# EAGLE board swift-nav (EAGLE 6.2), part 1 of 2
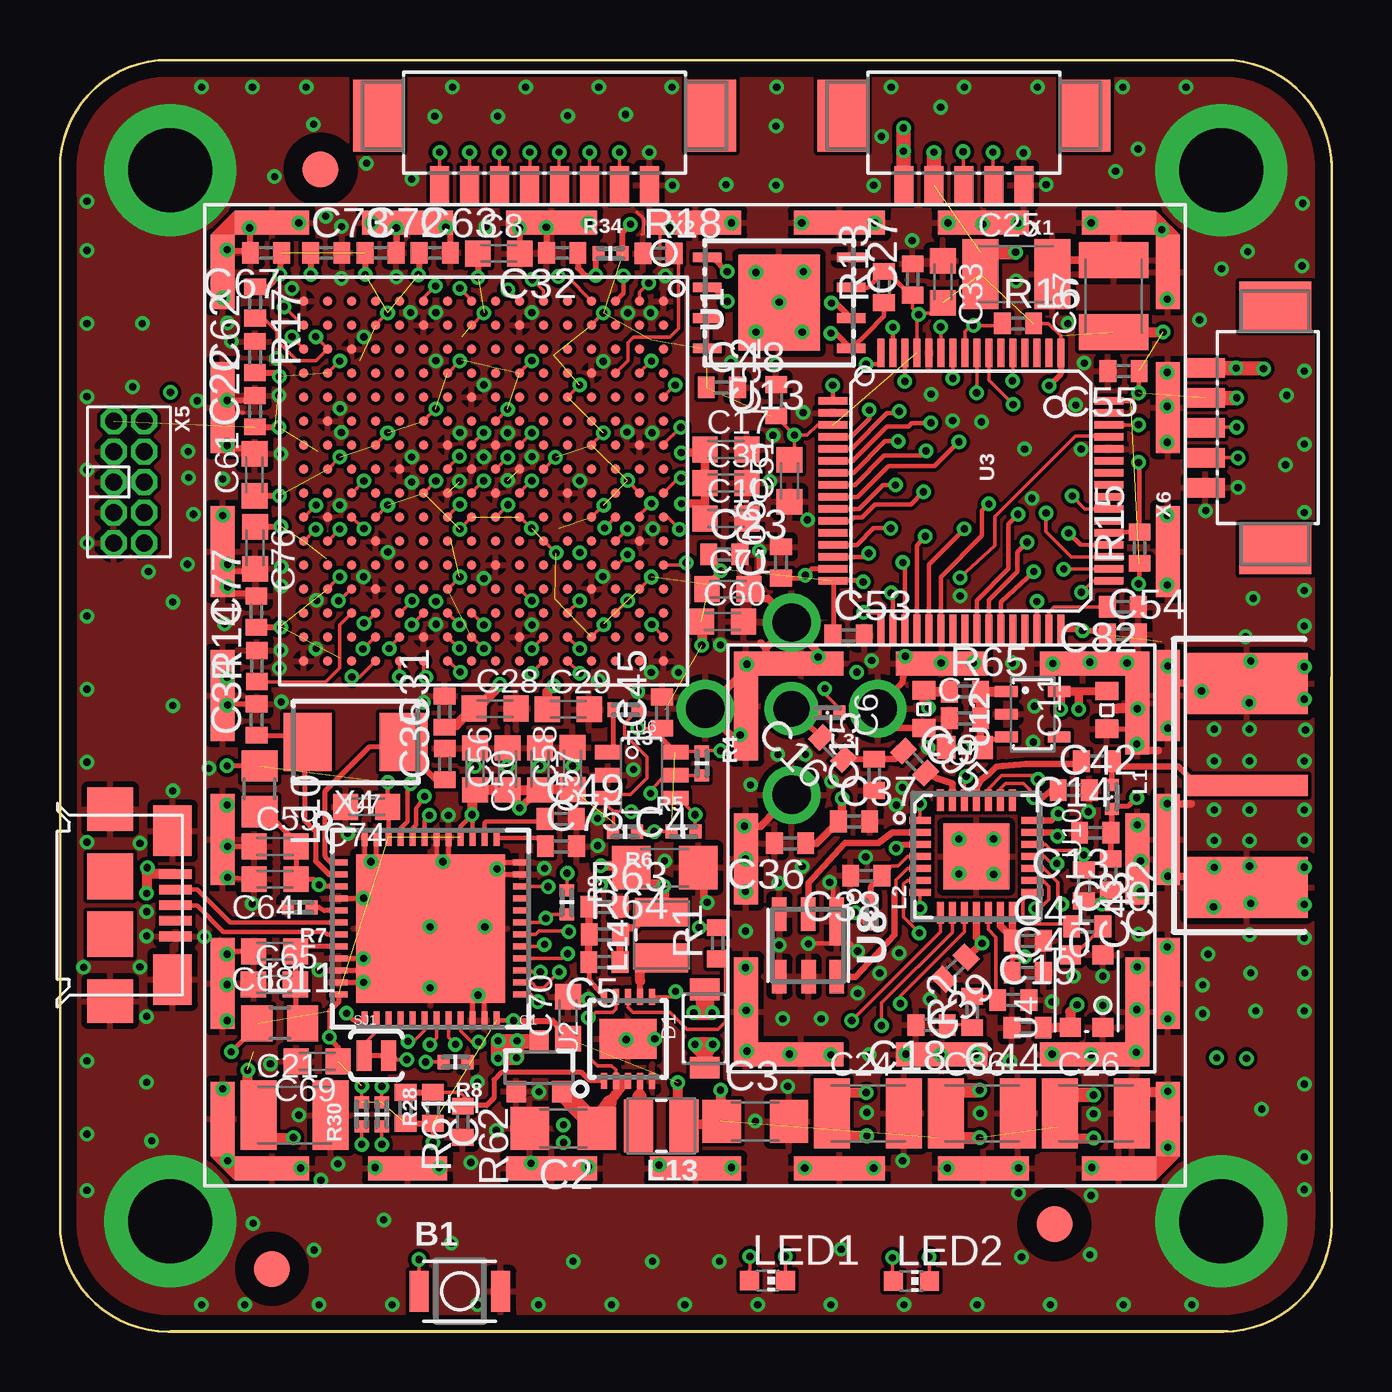
[diagram p4: board, top side]
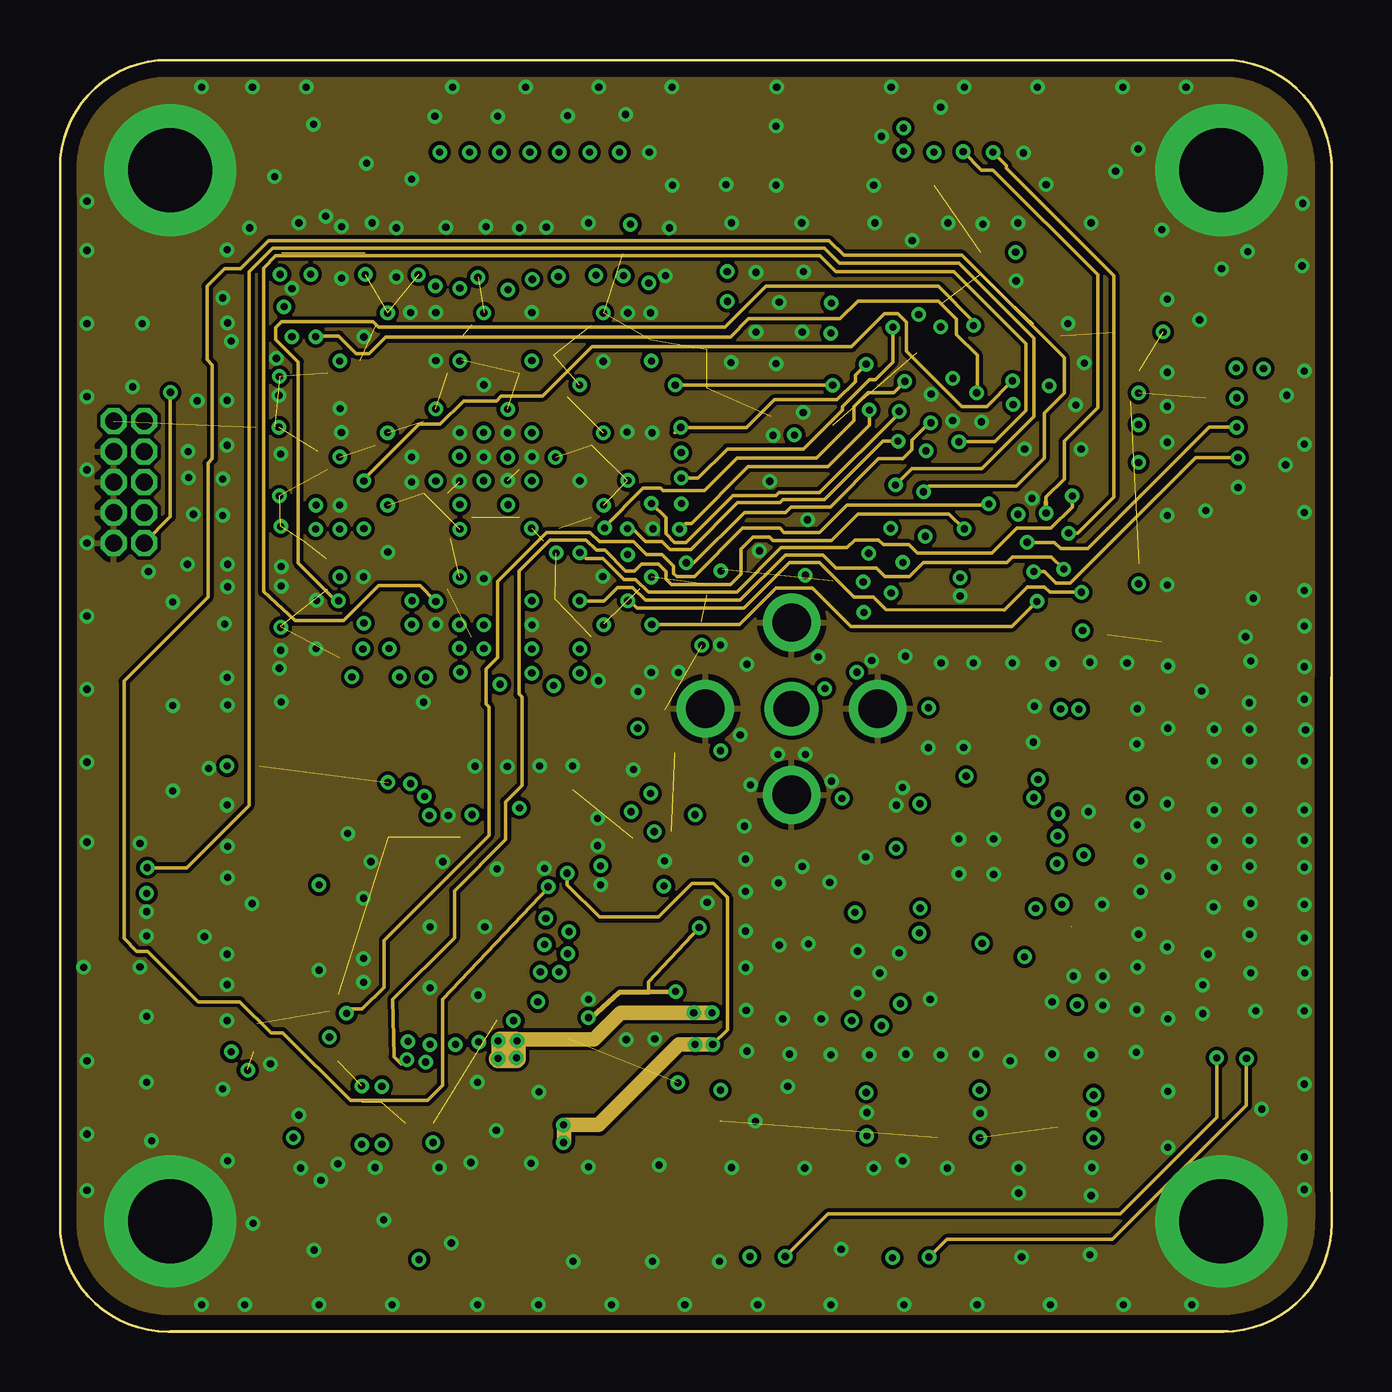
[diagram p5: board, inner layer Route2]
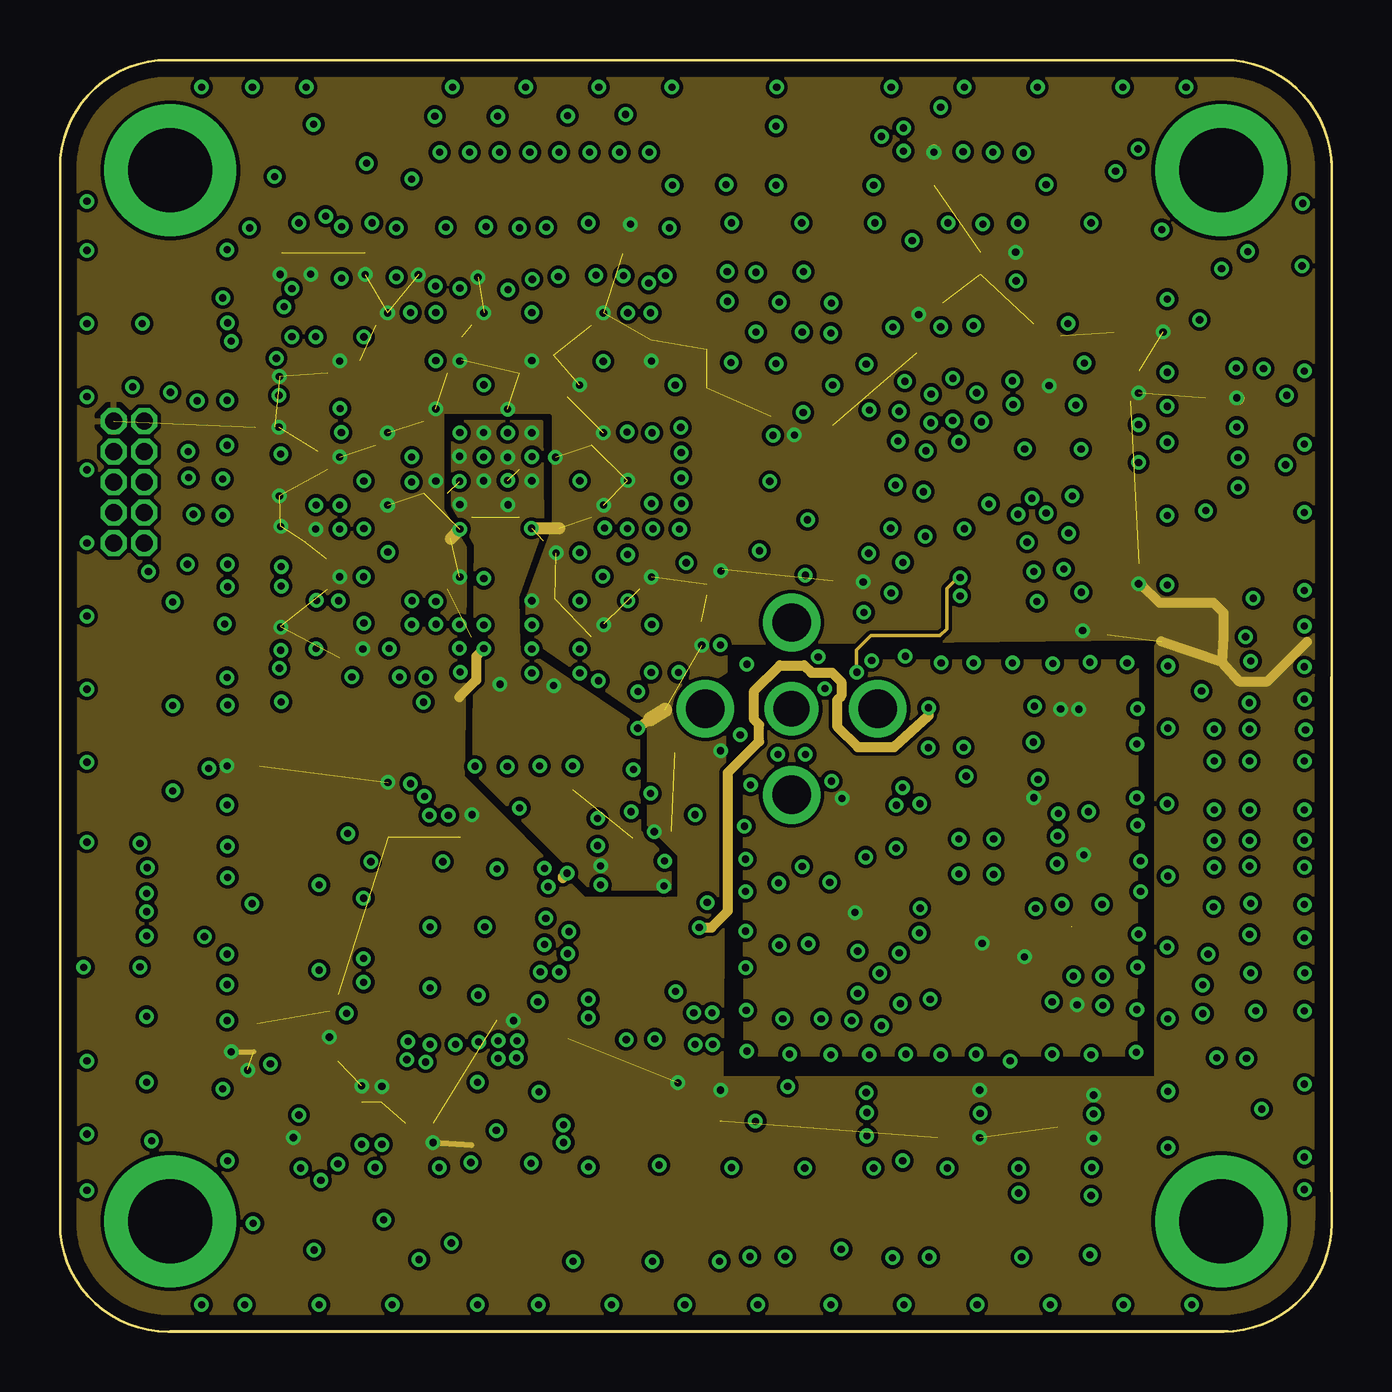
[diagram p6: board, inner layer Route3]
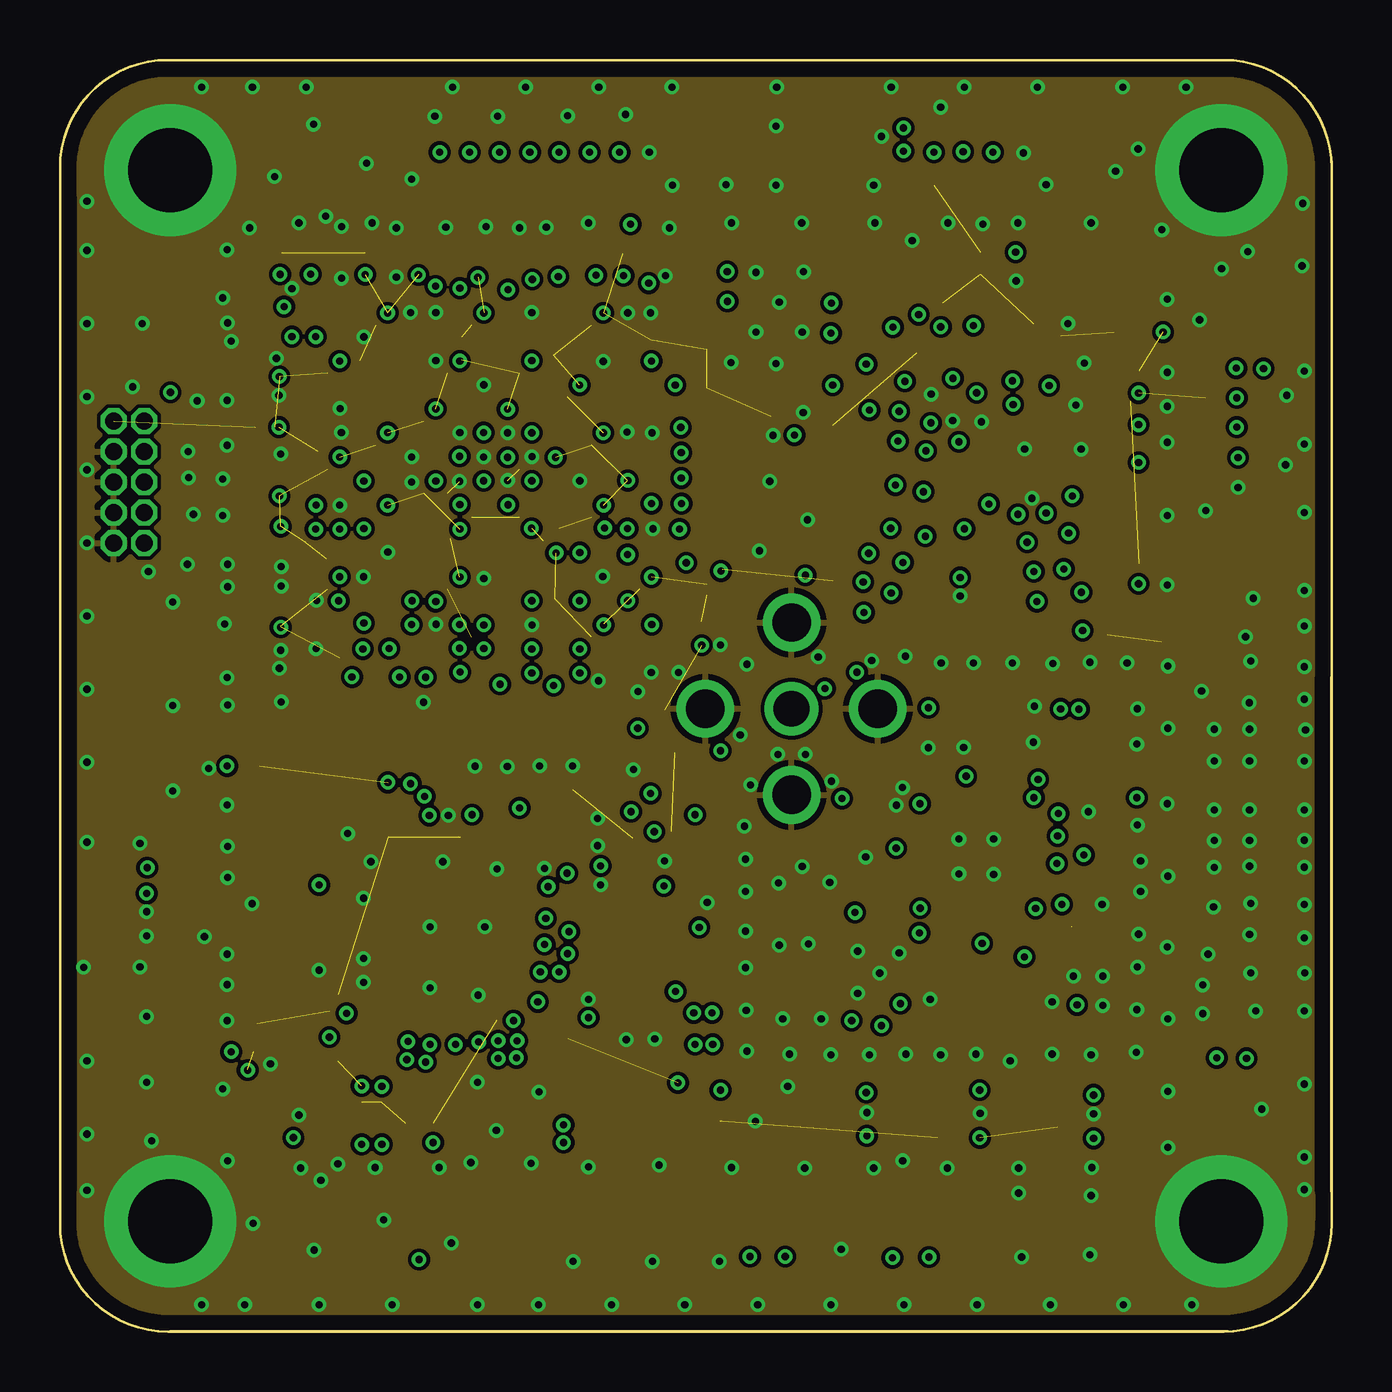
[diagram p7: board, inner layer Route14]
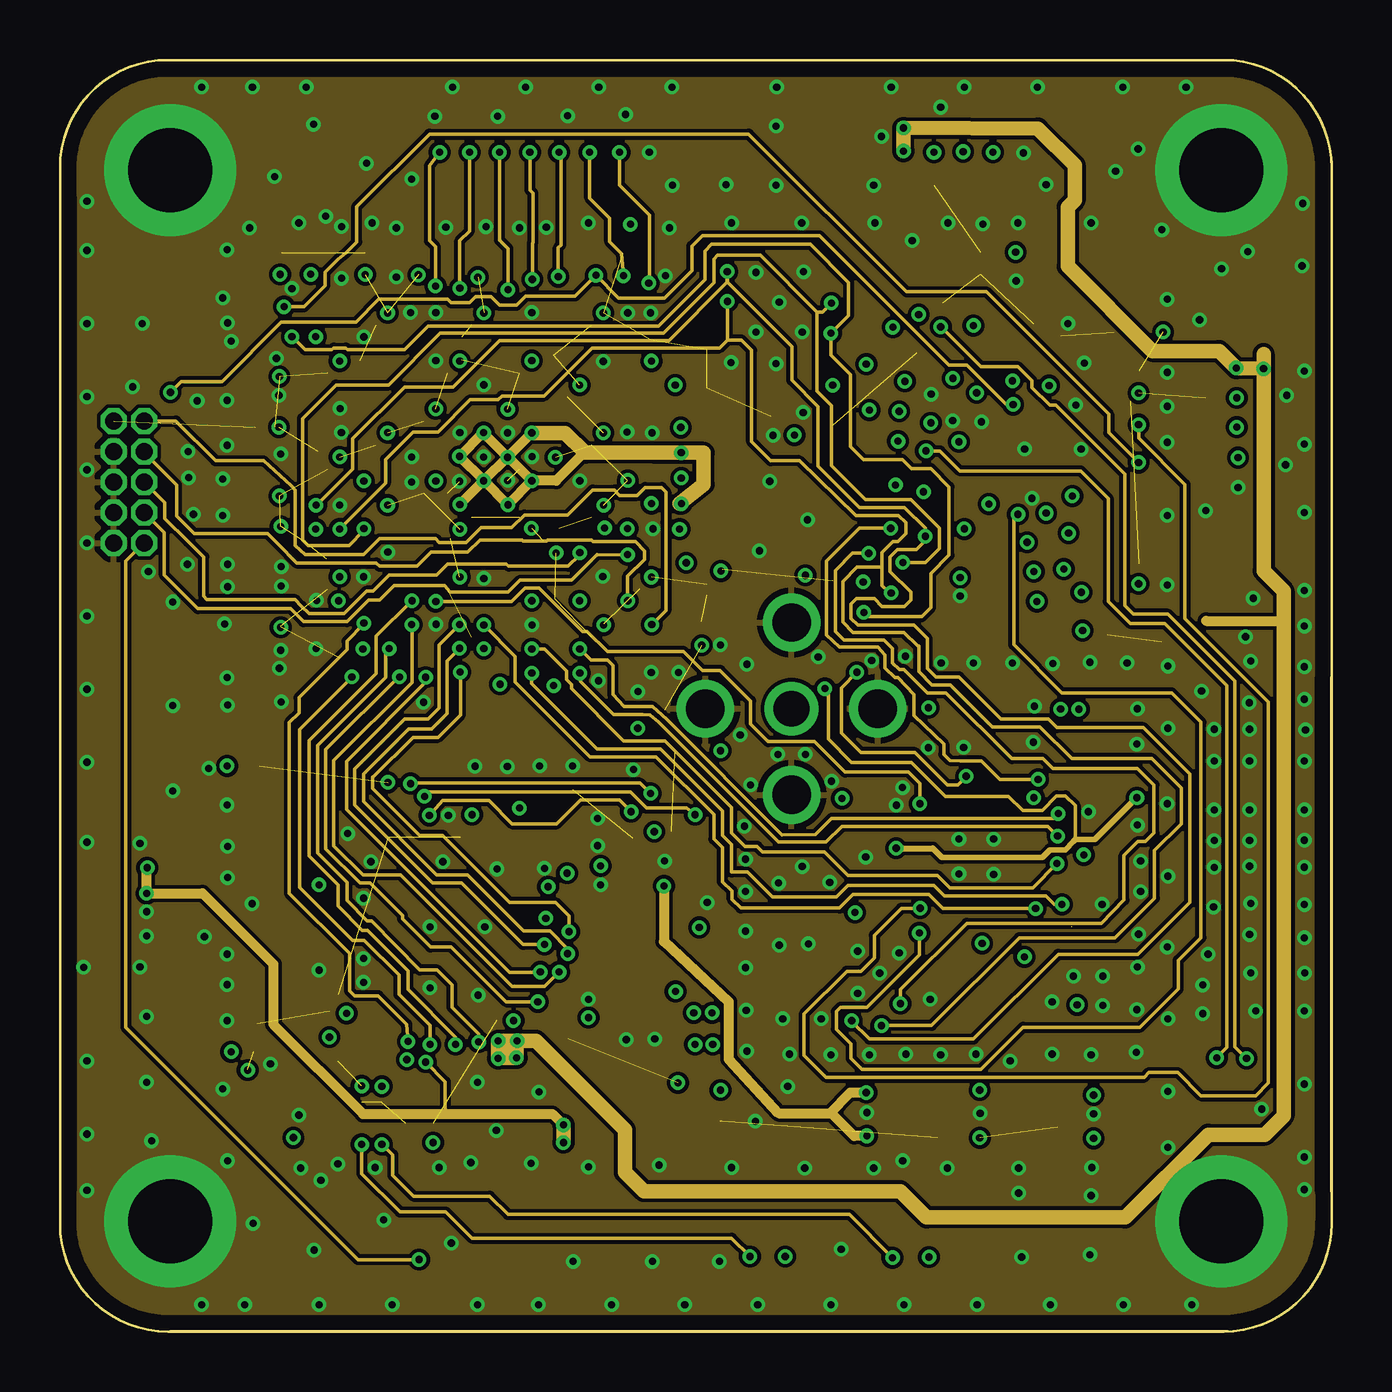
[diagram p8: board, inner layer Route15]
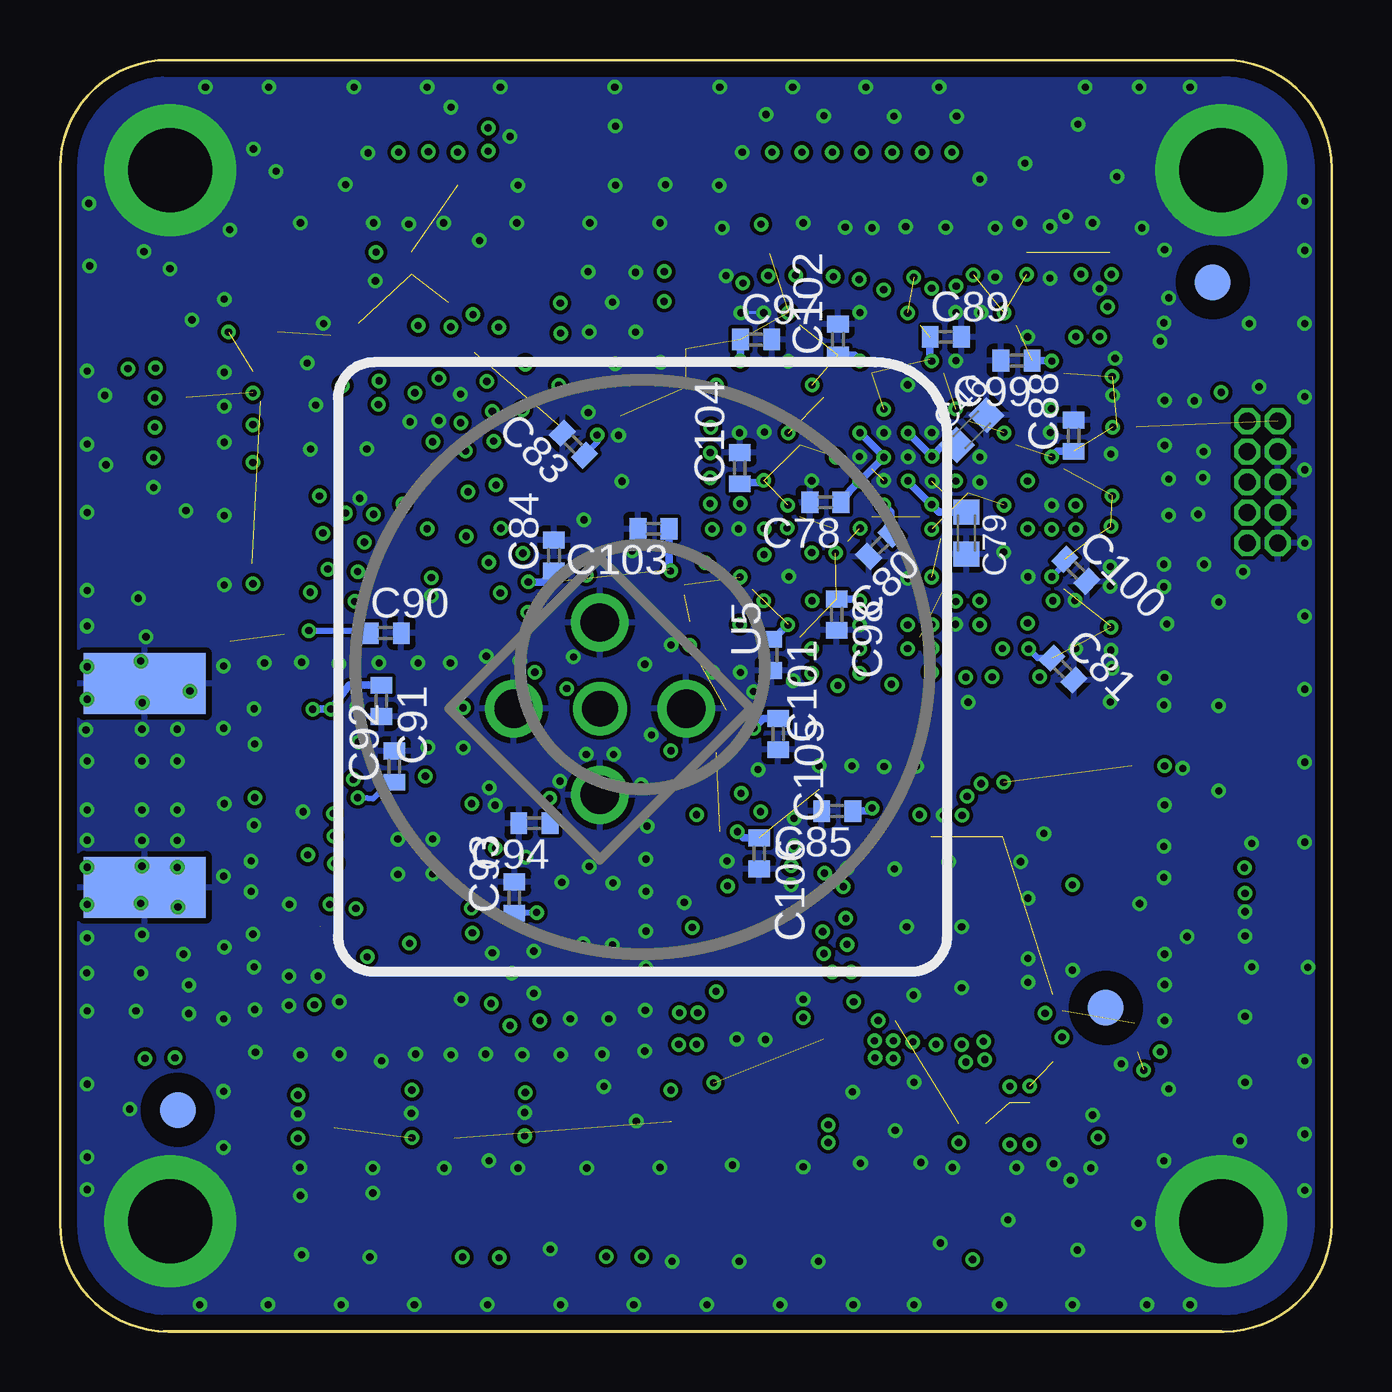
[diagram p9: board, bottom side, seen from below]

Size 53 x 53 mm. Coordinates in mm from the lower left corner, seen from the top.
Outline: 48.67,53 4.6,53
Outline: 0,47.3 0,5.86
Outline: 4.6,0 48.68,0
Outline: 53,5.85 53,48.76
Outline: 4.5,53 48.5,53 arc-90 53,48.5 53,4.5 arc-90 48.5,0 4.5,0 arc-90 0,4.5 0,48.5 arc-90 4.5,53
Copper layers (1+2*3+14*15+16): Top 0.0175mm / dielectric 0.15mm / Route2 0.0175mm / dielectric 0.5mm / Route3 0.0175mm / dielectric 0.15mm / Route14 0.0175mm / dielectric 0.5mm / Route15 0.0175mm / dielectric 0.15mm / Bottom 0.0175mm
Design rules: minimum track width 6mil, minimum drill 0.3mm, track to track 6mil, track to pad 6mil, pad to pad 6mil, via to via 6mil, smd to smd 6mil, copper to edge 25mil, drill to drill 8mil, minimum pad ring 7.5mil, minimum via ring 6mil, stop-mask expansion 3mil, vias tented up to drill 0.4mm, thermal gap 10mil

## Footprints (pad centres in the part's own frame; a part is rotated, then mirrored left to right if it is on the bottom)
B3U-1000P = smd 0.8 x 1.7: P$1 -1.7,0; P$2 1.7,0
C0402 = smd 0.7 x 0.9: 1 -0.65,0; 2 0.65,0
C1206 = smd 1.6 x 1.8: 1 -1.4,0; 2 1.4,0
0603 = smd 0.762 x 0.965: 1 -0.787,0; 2 0.787,0
C0603K = smd 1.05 x 1.08: 1 -0.875,0; 2 0.875,0
C1210K = smd 1.5 x 2.9: 1 -1.5,0; 2 1.5,0
SOD-123 = smd 0.914 x 1.219: 1 -1.626,0; 2 1.626,0
M3-PAD = drill 3.5 pad 5.5: B3,0 0,0
SMA_EDGE = smd 0.889 x 5.08: P1 0,-2.54 | smd 2.54 x 5.08: P2 -4.242,-2.54; P3 4.242,-2.54 | smd 2.54 x 5.08 bottom: P4 -4.242,-2.54; P5 4.242,-2.54
ZX62-B-5PA = smd 1.8 x 1.9: GND_LEFT -4,0; GND_RIGHT 4,0 | smd 1.9 x 1.9: GND_MID_LEFT -1.2,0; GND_MID_RIGHT 1.2,0 | smd 2.1 x 1.6: GND_UP_LEFT -3.1,2.6; GND_UP_RIGHT 3.1,2.6 | smd 0.4 x 1.35: PIN_1 -1.3,2.725; PIN_2 -0.65,2.725; PIN_3 0,2.725; PIN_4 0.65,2.725; PIN_5 1.3,2.725
FIDUCIAL-1.5X3 = smd 1.5 x 1.5: 1 0,0
0402-IND = smd 0.5 x 0.6: P$1 -0.5,0; P$2 0.5,0
R0805 = smd 1.3 x 1.5: 1 -0.95,0; 2 0.95,0
LQM2HPN4R7MG0L = smd 1.2 x 2.2: 1 -0.95,0; 2 0.95,0
CHIP-LED0603 = smd 0.8 x 0.8: A 0,-0.75; C 0,0.75
SOT23-3 = smd 0.8 x 0.9: 1 -0.95,-1; 2 0.95,-1; 3 0,1.1
R0402 = smd 0.7 x 0.9: 1 -0.65,0; 2 0.65,0
0402-RES = smd 0.5 x 0.6: P$1 -0.5,0; P$2 0.5,0
BMI-S-202 = smd 4.55 x 1: 1 2.275,0.5; 3 15.025,0.5; 7 15.025,16.8 | smd 3.8 x 1: 2 8.65,0.5; 8 8.65,16.8 | smd 1 x 3.55: 4 16.8,2.775; 6 16.8,14.525; 10 0.5,14.525; 12 0.5,2.775 | smd 1 x 3.8: 5 16.8,8.65; 11 0.5,8.65 | smd 4.296 x 1: 9 2.148,16.8
BMI-S-208 = smd 3.1 x 1: 1 2.55,0.5; 3 37.85,0.5; 7 37.85,39.9; 9 2.55,39.9 | smd 3.8 x 1: 2 8.2,0.5; 8 8.2,39.9; 13 14.2,0.5; 14 20.2,0.5; 15 26.2,0.5; 16 32.2,0.5; 25 14.2,39.9; 26 20.2,39.9; 27 26.2,39.9; 28 32.2,39.9 | smd 1 x 3.1: 4 39.9,2.55; 6 39.9,37.85; 10 0.5,37.85; 12 0.5,2.55 | smd 1 x 3.3: 5 39.9,8.2 | smd 1 x 3.8: 11 0.5,8.2; 17 39.9,14.2; 18 39.9,20.2; 19 39.9,32.2; 20 0.5,14.2; 21 39.9,26.2; 22 0.5,20.2; 23 0.5,26.2; 24 0.5,32.2
SJ_2S-TRACE = smd 0.635 x 1.27: 1 -0.508,0; 2 0.508,0
FT256 = smd 0.4 x 0.4: A1 -7.5,7.5; A2 -6.5,7.5; A3 -5.5,7.5; A4 -4.5,7.5; A5 -3.5,7.5; A6 -2.5,7.5; A7 -1.5,7.5; A8 -0.5,7.5; A9 0.5,7.5; A10 1.5,7.5; A11 2.5,7.5; A12 3.5,7.5; A13 4.5,7.5; A14 5.5,7.5; A15 6.5,7.5; A16 7.5,7.5; B1 -7.5,6.5; B2 -6.5,6.5; B3 -5.5,6.5; B4 -4.5,6.5; B5 -3.5,6.5; B6 -2.5,6.5; B7 -1.5,6.5; B8 -0.5,6.5; B9 0.5,6.5; B10 1.5,6.5; B11 2.5,6.5; B12 3.5,6.5; B13 4.5,6.5; B14 5.5,6.5; B15 6.5,6.5; B16 7.5,6.5; C1 -7.5,5.5; C2 -6.5,5.5; C3 -5.5,5.5; C4 -4.5,5.5; C5 -3.5,5.5; C6 -2.5,5.5; C7 -1.5,5.5; C8 -0.5,5.5; C9 0.5,5.5; C10 1.5,5.5; C11 2.5,5.5; C12 3.5,5.5; C13 4.5,5.5; C14 5.5,5.5; C15 6.5,5.5; C16 7.5,5.5; D1 -7.5,4.5; D2 -6.5,4.5; D3 -5.5,4.5; D4 -4.5,4.5; D5 -3.5,4.5; D6 -2.5,4.5; D7 -1.5,4.5; D8 -0.5,4.5; D9 0.5,4.5; D10 1.5,4.5; D11 2.5,4.5; D12 3.5,4.5; D13 4.5,4.5; D14 5.5,4.5; D15 6.5,4.5; D16 7.5,4.5; E1 -7.5,3.5; E2 -6.5,3.5; E3 -5.5,3.5; E4 -4.5,3.5; E5 -3.5,3.5; E6 -2.5,3.5; E7 -1.5,3.5; E8 -0.5,3.5; E9 0.5,3.5; E10 1.5,3.5; E11 2.5,3.5; E12 3.5,3.5; E13 4.5,3.5; E14 5.5,3.5; E15 6.5,3.5; E16 7.5,3.5; F1 -7.5,2.5; F2 -6.5,2.5; F3 -5.5,2.5; F4 -4.5,2.5; F5 -3.5,2.5; F6 -2.5,2.5; F7 -1.5,2.5; F8 -0.5,2.5; F9 0.5,2.5; F10 1.5,2.5; F11 2.5,2.5; F12 3.5,2.5; F13 4.5,2.5; F14 5.5,2.5; F15 6.5,2.5; F16 7.5,2.5; G1 -7.5,1.5; G2 -6.5,1.5; G3 -5.5,1.5; G4 -4.5,1.5; G5 -3.5,1.5; G6 -2.5,1.5; G7 -1.5,1.5; G8 -0.5,1.5; G9 0.5,1.5; G10 1.5,1.5; G11 2.5,1.5; G12 3.5,1.5; G13 4.5,1.5; G14 5.5,1.5; G15 6.5,1.5; G16 7.5,1.5; H1 -7.5,0.5; H2 -6.5,0.5; H3 -5.5,0.5; H4 -4.5,0.5; H5 -3.5,0.5; H6 -2.5,0.5; H7 -1.5,0.5; H8 -0.5,0.5; H9 0.5,0.5; H10 1.5,0.5; H11 2.5,0.5; H12 3.5,0.5; H13 4.5,0.5; H14 5.5,0.5; H15 6.5,0.5; H16 7.5,0.5; J1 -7.5,-0.5; J2 -6.5,-0.5; J3 -5.5,-0.5; J4 -4.5,-0.5; J5 -3.5,-0.5; J6 -2.5,-0.5; J7 -1.5,-0.5; J8 -0.5,-0.5; J9 0.5,-0.5; J10 1.5,-0.5; J11 2.5,-0.5; J12 3.5,-0.5; J13 4.5,-0.5; J14 5.5,-0.5; J15 6.5,-0.5; J16 7.5,-0.5; K1 -7.5,-1.5; K2 -6.5,-1.5; K3 -5.5,-1.5; K4 -4.5,-1.5; K5 -3.5,-1.5; K6 -2.5,-1.5; K7 -1.5,-1.5; K8 -0.5,-1.5; K9 0.5,-1.5; K10 1.5,-1.5; K11 2.5,-1.5; K12 3.5,-1.5; K13 4.5,-1.5; K14 5.5,-1.5; K15 6.5,-1.5; K16 7.5,-1.5; L1 -7.5,-2.5; L2 -6.5,-2.5; L3 -5.5,-2.5; L4 -4.5,-2.5; L5 -3.5,-2.5; L6 -2.5,-2.5; L7 -1.5,-2.5; L8 -0.5,-2.5; L9 0.5,-2.5; L10 1.5,-2.5; L11 2.5,-2.5; L12 3.5,-2.5; L13 4.5,-2.5; L14 5.5,-2.5; L15 6.5,-2.5; L16 7.5,-2.5; M1 -7.5,-3.5; M2 -6.5,-3.5; M3 -5.5,-3.5; M4 -4.5,-3.5; M5 -3.5,-3.5; M6 -2.5,-3.5; M7 -1.5,-3.5; M8 -0.5,-3.5; M9 0.5,-3.5; M10 1.5,-3.5; M11 2.5,-3.5; M12 3.5,-3.5; M13 4.5,-3.5; M14 5.5,-3.5; M15 6.5,-3.5; M16 7.5,-3.5; N1 -7.5,-4.5; N2 -6.5,-4.5; N3 -5.5,-4.5; N4 -4.5,-4.5; N5 -3.5,-4.5; N6 -2.5,-4.5; N7 -1.5,-4.5; N8 -0.5,-4.5; N9 0.5,-4.5; N10 1.5,-4.5; N11 2.5,-4.5; N12 3.5,-4.5; N13 4.5,-4.5; N14 5.5,-4.5; N15 6.5,-4.5; N16 7.5,-4.5; P1 -7.5,-5.5; P2 -6.5,-5.5; P3 -5.5,-5.5; P4 -4.5,-5.5; P5 -3.5,-5.5; P6 -2.5,-5.5; P7 -1.5,-5.5; P8 -0.5,-5.5; P9 0.5,-5.5; P10 1.5,-5.5; P11 2.5,-5.5; P12 3.5,-5.5; P13 4.5,-5.5; P14 5.5,-5.5; P15 6.5,-5.5; P16 7.5,-5.5; R1 -7.5,-6.5; R2 -6.5,-6.5; R3 -5.5,-6.5; R4 -4.5,-6.5; R5 -3.5,-6.5; R6 -2.5,-6.5; R7 -1.5,-6.5; R8 -0.5,-6.5; R9 0.5,-6.5; R10 1.5,-6.5; R11 2.5,-6.5; R12 3.5,-6.5; R13 4.5,-6.5; R14 5.5,-6.5; R15 6.5,-6.5; R16 7.5,-6.5; T1 -7.5,-7.5; T2 -6.5,-7.5; T3 -5.5,-7.5; T4 -4.5,-7.5; T5 -3.5,-7.5; T6 -2.5,-7.5; T7 -1.5,-7.5; T8 -0.5,-7.5; T9 0.5,-7.5; T10 1.5,-7.5; T11 2.5,-7.5; T12 3.5,-7.5; T13 4.5,-7.5; T14 5.5,-7.5; T15 6.5,-7.5; T16 7.5,-7.5
DFN10 = smd 0.25 x 0.68: 1 -1,-1.75; 2 -0.5,-1.75; 3 0,-1.75; 4 0.5,-1.75; 5 1,-1.75; 6 1,1.75; 7 0.5,1.75; 8 0,1.75; 9 -0.5,1.75; 10 -1,1.75 | smd 2.38 x 1.65: 11 0,0
LQFP64 = smd 1.2 x 0.3: 1 -5.75,3.75; 2 -5.75,3.25; 3 -5.75,2.75; 4 -5.75,2.25; 5 -5.75,1.75; 6 -5.75,1.25; 7 -5.75,0.75; 8 -5.75,0.25; 9 -5.75,-0.25; 10 -5.75,-0.75; 11 -5.75,-1.25; 12 -5.75,-1.75; 13 -5.75,-2.25; 14 -5.75,-2.75; 15 -5.75,-3.25; 16 -5.75,-3.75; 33 5.75,-3.75; 34 5.75,-3.25; 35 5.75,-2.75; 36 5.75,-2.25; 37 5.75,-1.75; 38 5.75,-1.25; 39 5.75,-0.75; 40 5.75,-0.25; 41 5.75,0.25; 42 5.75,0.75; 43 5.75,1.25; 44 5.75,1.75; 45 5.75,2.25; 46 5.75,2.75; 47 5.75,3.25; 48 5.75,3.75 | smd 0.3 x 1.2: 17 -3.75,-5.75; 18 -3.25,-5.75; 19 -2.75,-5.75; 20 -2.25,-5.75; 21 -1.75,-5.75; 22 -1.25,-5.75; 23 -0.75,-5.75; 24 -0.25,-5.75; 25 0.25,-5.75; 26 0.75,-5.75; 27 1.25,-5.75; 28 1.75,-5.75; 29 2.25,-5.75; 30 2.75,-5.75; 31 3.25,-5.75; 32 3.75,-5.75; 49 3.75,5.75; 50 3.25,5.75; 51 2.75,5.75; 52 2.25,5.75; 53 1.75,5.75; 54 1.25,5.75; 55 0.75,5.75; 56 0.25,5.75; 57 -0.25,5.75; 58 -0.75,5.75; 59 -1.25,5.75; 60 -1.75,5.75; 61 -2.25,5.75; 62 -2.75,5.75; 63 -3.25,5.75; 64 -3.75,5.75
TCX_7Q = smd 0.78 x 0.87: 1 -1.51,-0.68; 2 1.51,-0.68; 3 1.51,0.68; 4 -1.51,0.68
SMA_PATCH = drill 1.499: P1 1.742,-1.778 | drill 1.6: P2 1.742,1.814; P3 5.334,-1.778; P4 1.742,-5.37; P5 -1.85,-1.778
93AA56BT-I/OT = smd 0.6 x 1.1: 1 -0.95,-1.4; 2 0,-1.4; 3 0.95,-1.4; 4 0.95,1.4; 5 0,1.4; 6 -0.95,1.4
FT232HQ = smd 0.75 x 0.25: 1 -3.825,2.75; 2 -3.825,2.25; 3 -3.825,1.75; 4 -3.825,1.25; 5 -3.825,0.75; 6 -3.825,0.25; 7 -3.825,-0.25; 8 -3.825,-0.75; 9 -3.825,-1.25; 10 -3.825,-1.75; 11 -3.825,-2.25; 12 -3.825,-2.75; 25 3.825,-2.75; 26 3.825,-2.25; 27 3.825,-1.75; 28 3.825,-1.25; 29 3.825,-0.75; 30 3.825,-0.25; 31 3.825,0.25; 32 3.825,0.75; 33 3.825,1.25; 34 3.825,1.75; 35 3.825,2.25; 36 3.825,2.75 | smd 0.25 x 0.75: 13 -2.75,-3.825; 14 -2.25,-3.825; 15 -1.75,-3.825; 16 -1.25,-3.825; 17 -0.75,-3.825; 18 -0.25,-3.825; 19 0.25,-3.825; 20 0.75,-3.825; 21 1.25,-3.825; 22 1.75,-3.825; 23 2.25,-3.825; 24 2.75,-3.825; 37 2.75,3.825; 38 2.25,3.825; 39 1.75,3.825; 40 1.25,3.825; 41 0.75,3.825; 42 0.25,3.825; 43 -0.25,3.825; 44 -0.75,3.825; 45 -1.25,3.825; 46 -1.75,3.825; 47 -2.25,3.825; 48 -2.75,3.825 | smd 6.2 x 6.2: 49 0,0
B4050 = smd 2 x 0.6: 1 -1,1.2 | smd 1.4 x 0.6: 2 -1.3,0; 3 -1.3,-1.2; 4 1.3,-1.2; 5 1.3,0.025; 6 1.3,1.2
MAX2769 = smd 0.3 x 0.9: 1 -1.5,-2.34; 2 -1,-2.34; 3 -0.5,-2.34; 4 0,-2.34; 5 0.5,-2.34; 6 1,-2.34; 7 1.5,-2.34; 15 1.5,2.34; 16 1,2.34; 17 0.5,2.34; 18 0,2.34; 19 -0.5,2.34; 20 -1,2.34; 21 -1.5,2.34 | smd 0.9 x 0.3: 8 2.34,-1.5; 9 2.34,-1; 10 2.34,-0.5; 11 2.34,0; 12 2.34,0.5; 13 2.34,1; 14 2.34,1.5; 22 -2.34,1.5; 23 -2.34,1; 24 -2.34,0.5; 25 -2.34,0; 26 -2.34,-0.5; 27 -2.34,-1; 28 -2.34,-1.5 | smd 2.75 x 2.75: 29 0,0
PT7M8206B33TA5EX = smd 0.45 x 0.95: 1 0.95,1.1; 2 0,1.1; 3 -0.95,1.1; 4 -0.95,-1.1; 5 0.95,-1.1
M25P80_MLP8 = smd 1.2 x 0.4: 1 -3,1.9; 2 -3,0.64; 3 -3,-0.64; 4 -3,-1.9; 5 3,-1.9; 6 3,-0.64; 7 3,0.64; 8 3,1.9 | smd 3.4 x 4: 9 0,0
PB-53261-05 = smd 0.8 x 1.6: 1 -2.5,1.1; 2 -1.25,1.1; 3 0,1.1; 4 1.25,1.1; 5 2.5,1.1 | smd 2.1 x 3: MNT1 -5.05,-1.8; MNT2 5.05,-1.8
PB-53261-08 = smd 0.8 x 1.6: 1 -4.375,1.1; 2 -3.125,1.1; 3 -1.875,1.1; 4 -0.625,1.1; 5 0.625,1.1; 6 1.875,1.1; 7 3.125,1.1; 8 4.375,1.1 | smd 2.1 x 3: MNT1 -6.925,-1.8; MNT2 6.925,-1.8
NX5032GA = smd 2 x 2.4: 1 -2,0; 2 2,0
FTSH-105-D = drill 0.71 pad 1.016 octagon: 1 -2.54,-0.635; 2 -2.54,0.635; 3 -1.27,-0.635; 4 -1.27,0.635; 5 0,-0.635; 6 0,0.635; 7 1.27,-0.635; 8 1.27,0.635; 9 2.54,-0.635; 10 2.54,0.635

## Placement (x,y rotation side)
B1  B3U-1000P  [B3U-1000P]  16.67,1.68 0 top
C1  22pF  [C0402]  15.55,9.33 270 top
C2  10uF  [C1206]  20.98,8.46 180 top
C3  10uF  [C1206]  28.99,8.77 0 top
C4  10uF  [C1206]  25.21,19.34 0 top
C5  22pF  [C0402]  22.69,15.4 180 top
C6  4.7uF  [0603]  36.01,25.94 90 top
C7  4.7uF  [0603]  37.72,24.34 0 top
C8  4.7uF  [C0603K]  18.29,44.94 0 top
C9  0.047uF  [C0402]  37.72,25.56 180 top
C10  4.7uF  [C0603K]  27.77,33.89 0 top
C11  4.7uF  [0603]  43.64,25.91 90 top
C12  100pF  [C0402]  43.79,19.05 270 top
C13  0.47uF  [C0402]  43.15,20.79 180 top
C14  100pF  [C0402]  43.22,23.77 180 top
C15  DNP  [C0402]  33.94,23.21 90 top
C16  0R  [C0402]  32.2,24.31 135 top
C17  4.7uF  [C0603K]  27.77,36.76 0 top
C18  470pF  [C0402]  36.33,12.78 180 top
C19  27pF  [C0402]  39.73,13.82 0 top
C20  0.047uF  [C0402]  42.82,16.89 0 top
C21  100uF  [C1210K]  9.78,9.02 0 top
C22  0.47uF  [C0402]  8.13,38.36 90 top
C23  0.47uF  [C0402]  27.69,32.39 0 top
C24  100uF  [C1210K]  33.68,9.1 0 top
C25  100uF  [C1210K]  39.86,44.07 0 top
C26  100uF  [C1210K]  43.18,9.1 0 top
C27  0.047uF  [C0402]  35.54,43.85 90 top
C28  4.7uF  [C0603K]  18.14,25.96 0 top
C29  4.7uF  [C0603K]  21.19,25.94 0 top
C30  4.7uF  [C0603K]  27.77,35.36 0 top
C31  0.47uF  [C0402]  16.03,25.84 90 top
C32  0.47uF  [C0402]  20.93,44.96 180 top
C33  4.7uF  [C0603K]  36.8,43.75 270 top
C34  20pF  [C0402]  8.2,25.5 90 top
C35  20pF  [C0402]  16.04,23.65 90 top
C36  0.47uF  [C0402]  30.43,20.35 180 top
C37  100pF  [C0402]  33.1,21.26 0 top
C38  12pF  [C0402]  33.61,19 180 top
C39  0.47uF  [C0402]  37.31,15.15 225 top
C40  0.47uF  [C0402]  40.34,14.96 0 top
C41  0.47uF  [C0402]  40.34,16.29 0 top
C42  0.47uF  [C0402]  42.26,22.56 0 top
C43  0.47uF  [C0402]  42.68,18.6 270 top
C44  0.47uF  [C0402]  40.33,12.67 180 top
C45  0.047uF  [C0402]  25.09,25.8 90 top
C46  4.7uF  [C0603K]  15,37.58 45 bottom
C48  0.47uF  [C0402]  27.59,39.35 0 top
C49  0.047uF  [C0402]  20.87,21.37 0 top
C50  4.7uF  [C0603K]  17.3,23.45 270 top
C51  4.7uF  [C0603K]  30.41,35.46 90 top
C52  0.47uF  [C0402]  29.85,38.81 90 top
C53  0.47uF  [C0402]  32.87,29.01 0 top
C54  0.47uF  [C0402]  44.3,29.06 0 top
C55  0.47uF  [C0402]  44.33,40.03 180 top
C56  0.047uF  [C0603K]  18.65,23.44 90 top
C57  4.7uF  [C0603K]  20.01,23.45 270 top
C58  0.047uF  [C0603K]  21.36,23.47 90 top
C59  4.7uF  [C0603K]  8.97,20.22 0 top
C60  4.7uF  [C0603K]  27.61,29.59 0 top
C61  4.7uF  [C0603K]  8.11,35.71 90 top
C62  0.47uF  [C0402]  8.13,40.62 90 top
C63  0.47uF  [C0402]  15.62,44.96 0 top
C64  0.047uF  [C0603K]  8.97,18.86 180 top
C65  4.7uF  [C0603K]  8.94,14.47 0 top
C66  0.47uF  [C0402]  30.05,32.06 90 top
C67  0.47uF  [C0402]  8.59,44.96 180 top
C68  0.047uF  [C0603K]  8.95,15.85 180 top
C69  0.047uF  [C0603K]  10.72,11.26 180 top
C70  0.047uF  [C0603K]  21.18,13.08 90 top
C71  4.7uF  [C0603K]  27.84,30.94 0 top
C72  0.47uF  [C0402]  13.36,44.96 0 top
C73  0.47uF  [C0402]  11.1,44.96 0 top
C74  0.047uF  [C0603K]  12.78,21.87 180 top
C75  0.047uF  [C0402]  20.88,20.22 0 top
C76  4.7uF  [C0603K]  8.13,32.67 270 top
C77  0.47uF  [C0402]  8.18,30.01 90 top
C78  0.47uF  [C0402]  21.1,34.56 180 bottom
C79  4.7uF  [C0603K]  15.22,33.29 270 bottom
C80  0.47uF  [C0402]  18.83,32.77 225 bottom
C81  0.47uF  [C0402]  11.2,27.61 315 bottom
C82  0.47uF  [C0402]  44.3,30.2 180 top
C83  0.47uF  [C0402]  31.6,36.98 135 bottom
C84  0.47uF  [C0402]  32.41,32.34 90 bottom
C85  0.47uF  [C0402]  20.6,21.7 180 bottom
C86  100uF  [C1210K]  38.43,9.1 0 top
C87  100uF  [C1210K]  43.92,43.16 90 top
C88  0.47uF  [C0402]  10.75,37.34 90 bottom
C89  0.47uF  [C0402]  16.08,41.46 0 bottom
C90  0.47uF  [C0402]  39.42,29.11 0 bottom
C91  0.47uF  [C0402]  39.6,26.29 270 bottom
C92  0.47uF  [C0402]  39.07,23.55 90 bottom
C93  0.47uF  [C0402]  34.07,18.09 90 bottom
C94  0.47uF  [C0402]  33.23,21.19 180 bottom
C95  100pF  [C0402]  35.62,23.74 315 top
C97  0.47uF  [C0402]  23.98,41.35 0 bottom
C98  0.47uF  [C0402]  20.63,29.88 270 bottom
C99  0.47uF  [C0402]  13.13,40.47 180 bottom
C100  0.47uF  [C0402]  10.66,31.73 315 bottom
C101  0.47uF  [C0402]  23.35,28.2 270 bottom
C102  0.47uF  [C0402]  20.58,41.35 90 bottom
C103  0.47uF  [C0402]  28.26,33.46 180 bottom
C104  0.47uF  [C0402]  24.67,35.99 90 bottom
C105  0.47uF  [C0402]  23.07,24.91 270 bottom
C106  0.47uF  [C0402]  23.86,19.93 270 bottom
D1  MBR0520  [SOD-123]  26.88,12.63 90 top
H2  MOUNT-PAD-ROUNDM3  [M3-PAD]  48.4,4.6 0 top
H3  MOUNT-PAD-ROUNDM3  [M3-PAD]  4.6,48.4 0 top
H4  MOUNT-PAD-ROUNDM3  [M3-PAD]  48.4,48.4 0 top
H5  MOUNT-PAD-ROUNDM3  [M3-PAD]  4.6,4.6 0 top
J1  SMA_EDGE  [SMA_EDGE]  52.01,22.76 270 top
J6  ZX62-B-5PA  [ZX62-B-5PA]  2.1,17.77 270 top
JP5  FIDUCIAL1.5X3  [FIDUCIAL-1.5X3]  48.09,9.23 180 bottom
JP6  FIDUCIAL1.5X3  [FIDUCIAL-1.5X3]  4.96,43.74 270 bottom
JP7  FIDUCIAL1.5X3  [FIDUCIAL-1.5X3]  9.41,13.49 270 bottom
JP8  FIDUCIAL1.5X3  [FIDUCIAL-1.5X3]  41.45,4.47 90 top
JP9  FIDUCIAL1.5X3  [FIDUCIAL-1.5X3]  10.86,48.44 90 top
JP10  FIDUCIAL1.5X3  [FIDUCIAL-1.5X3]  8.83,2.61 90 top
L1  250nH  [0402-IND]  43.84,22.28 270 top
L2  36nH  [0402-IND]  33.81,17.48 270 top
L3  250nH/DNP  [0402-IND]  31.98,25.78 180 top
L10  Ferrite 600/0.5  [R0805]  8.32,22.62 270 top
L11  Ferrite 600/0.5  [R0805]  9.16,12.85 0 top
L13  4.7uH  [LQM2HPN4R7MG0L]  25.06,8.57 180 top
L14  4.7uH  [LQM2HPN4R7MG0L]  25.07,16.53 90 top
LED1  RED  [CHIP-LED0603]  29.49,2.13 270 top
LED2  GREEN  [CHIP-LED0603]  35.49,2.1 270 top
Q1  IRLML6401  [SOT23-3]  19.97,11 0 top
R1  10K  [R0402]  27.41,16.19 90 top
R2  20k  [R0402]  38.02,13.31 90 top
R3  2K  [0402-RES]  23.58,25.91 180 top
R4  10k  [0402-RES]  26.76,23.68 270 top
R5  10k  [0402-RES]  25.98,20.85 0 top
R6  10k  [0402-RES]  23.55,20.84 180 top
R7  12k  [0402-RES]  9.99,17.68 180 top
R8  10K  [0402-RES]  16.48,11.24 180 top
R9  10k  [0402-RES]  21.13,17.89 270 top
R13  2K  [R0402]  34.34,43.54 90 top
R14  10K  [R0402]  8.21,27.74 90 top
R15  2K  [R0402]  45,32.67 90 top
R16  330  [R0402]  39.93,42.02 0 top
R17  2K  [R0402]  8.14,42.89 270 top
R18  2K  [R0402]  24.95,44.94 0 top
R28  150  [0402-RES]  13.42,9.05 270 top
R30  150  [0402-RES]  12.58,9.05 90 top
R34  DNP  [0402-RES]  22.94,44.94 0 top
R61  634K  [R0402]  14.41,9.33 270 top
R62  140K  [R0402]  16.79,8.75 270 top
R63  200k  [R0402]  22.7,17.7 0 top
R64  200k  [R0402]  22.71,16.55 0 top
R65  10  [R0402]  37.72,26.67 0 top
SHLD1  BMI-S-202  [BMI-S-202]  28.1,28.35 270 top
SHLD2  BMI-S-208  [BMI-S-208]  6.29,46.71 270 top
SJ1  SOLDERJUMPERTRACE  [SJ_2S-TRACE]  13.19,11.51 0 top
U1  6SLX9FTG256  [FT256]  17.67,35.46 270 top
U2  LTC3407A_DFN  [DFN10]  23.68,12.2 0 top
U3  STM32-M-64-LQFP  [LQFP64]  37.96,35.04 270 top
U4  7Q-16.368MBG-T  [TCX_7Q]  42.79,14.19 90 top
U5  SMA_PATCH  [SMA_PATCH]  28.72,27.7 270 bottom
U6  93LC56BT-I/OT  [93AA56BT-I/OT]  24.25,23.19 270 top
U7  FT232HQ  [FT232HQ]  15.44,16.79 0 top
U8  B4050  [B4050]  31.18,16.1 270 top
U10  MAX2769  [MAX2769]  38.19,19.8 270 top
U12  PT7M8206B33TA5EX  [PT7M8206B33TA5EX]  40.54,25.73 90 top
U13  M25PX80  [M25P80_MLP8]  29.98,42.88 180 top
U$1  LOGOINITIALS  [INITIALS]  36.45,30.97 0 bottom
X1  [PB-53261-05]  37.67,48.88 180 top
X2  [PB-53261-08]  20.2,48.88 180 top
X4  NX5032GA-12M  [NX5032GA]  12.33,24.57 180 top
X5  CONN_5-2  [FTSH-105-D]  2.87,35.41 270 top
X6  [PB-53261-05]  48.85,37.67 90 top